# EAGLE design Tag_V1 (EAGLE 9.3.0)
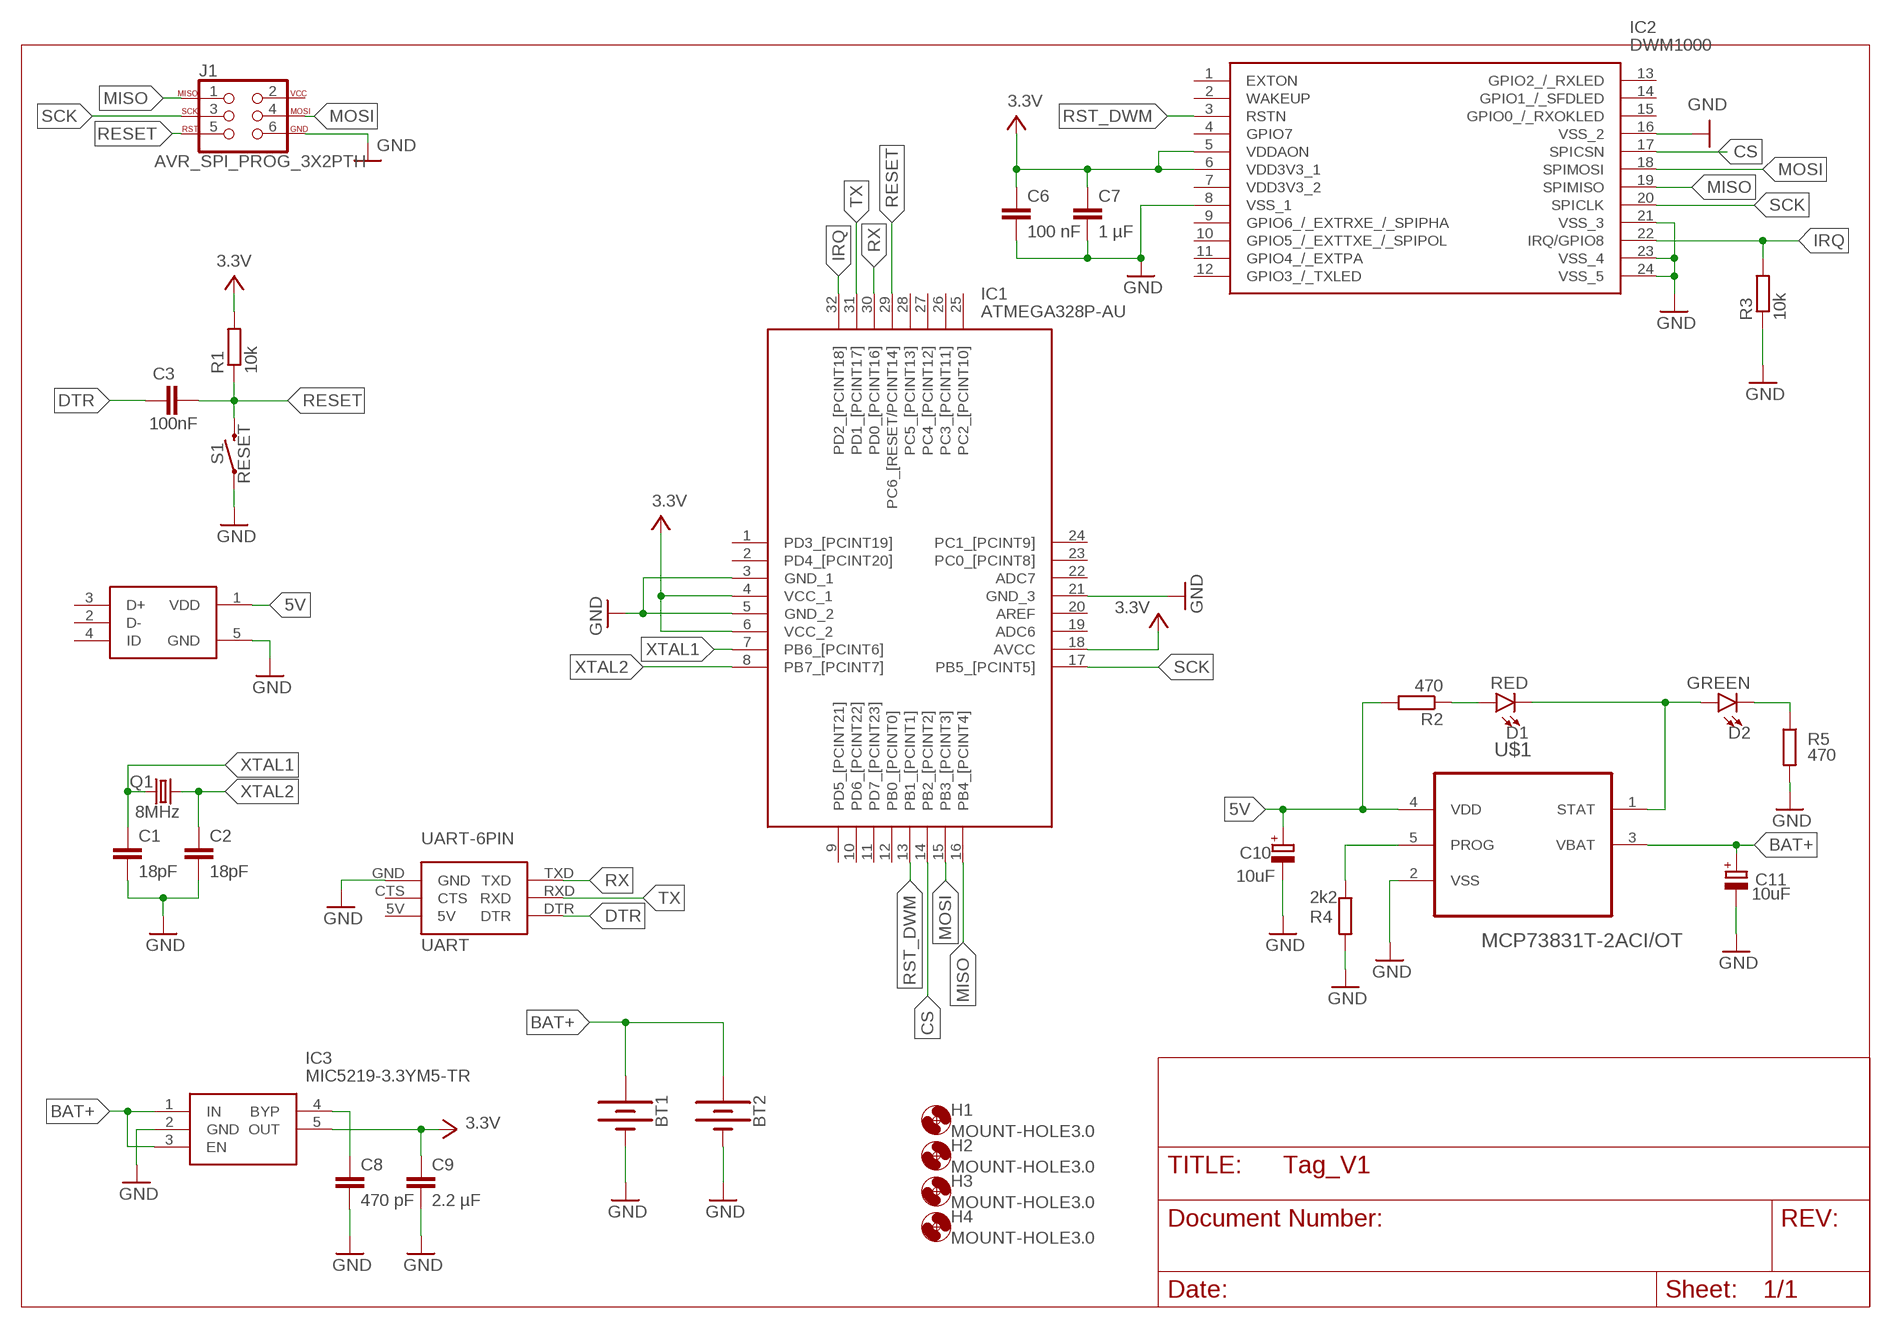
[diagram p0: schematic, sheet 1]

## Parts
BT1  BATTERY-18650  [BATTERY_18650-HOLDER]
BT2  BATTERY-18650  [BATTERY_18650-HOLDER]
C1  18pF  C-EUC0805  [C0805]
C2  18pF  C-EUC0805  [C0805]
C3  100nF  C-EUC0805  [C0805]
C6  100 nF  C-EUC0805  [C0805]
C7  1 µF  C-EUC0805  [C0805]
C8  470 pF  C-EUC0805  [C0805]
C9  2.2 µF  C-EUC0805  [C0805]
C10  10uF  CPOL-EUE2.5-7  [E2,5-7]
C11  10uF  CPOL-EUE2.5-7  [E2,5-7]
D1  RED  LED-RED1206  [LED-1206]
D2  GREEN  LED-GREEN1206  [LED-1206]
H1  MOUNT-HOLE3.0  [3,0]
H2  MOUNT-HOLE3.0  [3,0]
H3  MOUNT-HOLE3.0  [3,0]
H4  MOUNT-HOLE3.0  [3,0]
IC1  ATMEGA328P-AU  [QFP80P900X900X120-32N]
IC2  DWM1000  [DWM1000]
IC3  MIC5219-3.3YM5-TR  [SOT95P280X130-5N]
J1  AVR_SPI_PROG_3X2PTH  [2X3]
Q1  8MHz  CRYSTALHC49UP  [HC49UP]
R1  10k  R-EU_R0805  [R0805]
R2  470  R-EU_R0805  [R0805]
R3  10k  R-EU_R0805  [R0805]
R4  2k2  R-EU_R0805  [R0805]
R5  470  R-EU_R0805  [R0805]
S1  RESET  MOMENTARY-SWITCH-SPST-PTH-6.0MM  [TACTILE_SWITCH_PTH_6.0MM]
U1  105017-0001  [MOLEX_105017-0001]
U$1  MCP73831T-2ACI/OT  [SOT95P280X145-5N]
U$2  UART-6PIN  [UART-6PIN]

## Nets
3.3V: C6.1 C7.1 C9.1 IC1.4(VCC_1) IC1.6(VCC_2) IC1.18(AVCC) IC2.5(VDDAON) IC2.6(VDD3V3_1) IC3.5(OUT) R1.2 ; supply symbol labelled VCC
5V: C10.+ R2.2 U1.1(VDD) U$1.4(VDD)
BAT+: BT1.PWR@1(+) BT2.PWR@1(+) C11.+ IC3.1(IN) IC3.3(EN) U$1.3(VBAT)
CS: IC1.14(PB2_[PCINT2]) IC2.17(SPICSN)
DTR: C3.1 U$2.DTR
GND: BT1.GND@1(-) BT2.GND@1(-) C1.2 C2.2 C6.2 C7.2 C8.2 C9.2 C10.- C11.- IC1.3(GND_1) IC1.5(GND_2) IC1.21(GND_3) IC2.8(VSS_1) IC2.16(VSS_2) IC2.21(VSS_3) IC2.23(VSS_4) IC2.24(VSS_5) IC3.2(GND) J1.6 R3.1 R4.2 R5.2 S1.1 U1.5(GND) U$1.2(VSS) U$2.GND
IRQ: IC1.32(PD2_[PCINT18]) IC2.22(IRQ/GPIO8) R3.2
MISO: IC1.16(PB4_[PCINT4]) IC2.19(SPIMISO) J1.1
MOSI: IC1.15(PB3_[PCINT3]) IC2.18(SPIMOSI) J1.4
N$1: D1.C D2.A U$1.1(STAT)
N$2: D1.A R2.1
N$3: C8.1 IC3.4(BYP)
N$4: D2.C R5.1
N$6: R4.1 U$1.5(PROG)
RESET: C3.2 IC1.29(PC6_[RESET/PCINT14]) J1.5 R1.1 S1.3
RST_DWM: IC1.13(PB1_[PCINT1]) IC2.3(RSTN)
RX: IC1.30(PD0_[PCINT16]) U$2.TXD
SCK: IC1.17(PB5_[PCINT5]) IC2.20(SPICLK) J1.3
TX: IC1.31(PD1_[PCINT17]) U$2.RXD
XTAL1: C1.1 IC1.7(PB6_[PCINT6]) Q1.1
XTAL2: C2.1 IC1.8(PB7_[PCINT7]) Q1.2
Unconnected: IC1.1(PD3_[PCINT19]) IC1.2(PD4_[PCINT20]) IC1.9(PD5_[PCINT21]) IC1.10(PD6_[PCINT22]) IC1.11(PD7_[PCINT23]) IC1.12(PB0_[PCINT0]) IC1.19(ADC6) IC1.20(AREF) IC1.22(ADC7) IC1.23(PC0_[PCINT8]) IC1.24(PC1_[PCINT9]) IC1.25(PC2_[PCINT10]) IC1.26(PC3_[PCINT11]) IC1.27(PC4_[PCINT12]) IC1.28(PC5_[PCINT13]) IC2.1(EXTON) IC2.2(WAKEUP) IC2.4(GPIO7) IC2.7(VDD3V3_2) IC2.9(GPIO6_/_EXTRXE_/_SPIPHA) IC2.10(GPIO5_/_EXTTXE_/_SPIPOL) IC2.11(GPIO4_/_EXTPA) IC2.12(GPIO3_/_TXLED) IC2.13(GPIO2_/_RXLED) IC2.14(GPIO1_/_SFDLED) IC2.15(GPIO0_/_RXOKLED) J1.2 U1.2(D-) U1.3(D+) U1.4(ID) U$2.5V U$2.CTS

## Library data of the parts
BT1 BT2 = SparkFun-Batteries:BATTERY: Battery - Single Cell A variety of battery chemistries, sizes, and footprints. Device List: 20MM_PTH - Coin Cell Battery Holder - 20mm (PTH) <https://www.sparkfun.com/products/783> 20MM_PTH_KIT- Coin Cell battery Holder - 20 mm (PTH) <http://www.sparkfun.com/products/783>kit version with special mask 6.8MM_PTH - Coin Cell Battery Holder - 6.8MM(SMD) <https://www.digikey.com/product-detail/en/seiko-instruments/MS621FE-FL11E/728-1057-ND/1889208?WT.srch=1&gclid=CNOQ5a6LzdQCFZS2wAodXCkE0g> 12MM_SMD - Coin Cell Battery Holder - 12mm (SMD) <https://www.sparkfun.com/products/10592> 12MM_PTH - Coin Cell Battery Holder - 12mm (PTH) <https://www.sparkfun.com/products/7948> 20MM_SMD - 20mm Coin Cell Battery Holder (SMD) (2 legs) Used on the Big Time Watch Kit <https://www.sparkfun.com/products/11734> 20MM_SMD_4LEGS - Coin Cell Battery Holder - 20mm (SMD) <https://www.sparkfun.com/products/11892> 20MM_SMD_4LEGS_OVERPASTE - Coin Cell Battery Holder - 20mm (SMD) <https://www.sparkfun.com/products/11892> (Over-paste on the legs) 24.5MM_PTH - Coin Cell Battery Holder - 24.5mm (PTH) <https://www.sparkfun.com/products/8863> 9V - 9V Battery Holder - PC Mount Used on the SparkFun SparkPunk Sound Kit <https://www.sparkfun.com/products/11177> and SparkFun SparkPunk Sequencer Kit <https://www.sparkfun.com/products/12707> 18650 - Battery Holder - 18650 (PTH) <https://www.sparkfun.com/products/13113> AA - Battery Holder - 1xAA (PTH) <https://www.sparkfun.com/products/7949> AAA - Battery Holder - 1xAAA (PTH) <https://www.sparkfun.com/products/12718> AA_KIT - Battery Holder - 1xAA (PTH) <https://www.sparkfun.com/products/7949> Special kit package - pads only have exposed copper on one side of the board. AAA_KIT - Battery Holder - 1xAAA (PTH) <https://www.sparkfun.com/products/12718> Special kit package - pads only have exposed copper on one side of the board.; PROD_ID: BATT-12327; SF_SKU: PRT-13113
C1-C3 C6-C9 = rcl:C-EU: CAPACITOR, European symbol; SPICEPREFIX: C
C10 C11 = rcl:CPOL-EU: POLARIZED CAPACITOR, European symbol; SPICEPREFIX: C
D1 = SparkFun-LED:LED-RED: Red SMD LED Used in manufacturing of most products at SparkFun Packages: 0603 - SMD 0603 package [Product Link] <http://docs.avagotech.com/docs/AV02-0551EN> 0603 SMART - SMD 0603 SMART package ( more efficient and expensive)[Product Link] <http://www.osram-os.com/Graphics/XPic2/00077099_0.pdf> 1206 - SMD1206 package [Product Link] <https://www.sparkfun.com/datasheets/DevTools/LilyPad/Q150OVS4.pdff> SparkFun Products: Pro Mini 328 -5V <https://www.sparkfun.com/products/821> RedBoard <https://www.sparkfun.com/products/12757> IOIO-OTG <https://www.sparkfun.com/products/13613>; PROD_ID: DIO-09912
D2 = SparkFun-LED:LED-GREEN: Green SMD LED Used in manufacturing of various products at SparkFun Packages: 0603 - SMD 0603 package [Product Link] <http://www.futureelectronics.com/en/technologies/semiconductors/optoelectronics/leds/Pages/9894312-LTST-C190GKT.aspx?CrossPart=HSMG-C190&IM=0> LilyPad 1206 - SMD1206 LilyPad package [Product Link] <http://www.futureelectronics.com/en/Technologies/Product.aspx?ProductID=IN150NGHARVATEKCORPORATION2049943&IM=0> 1206 - SMD1206 package [Product Link] <http://www.futureelectronics.com/en/technologies/semiconductors/optoelectronics/leds/Pages/8315665-LTST-C150KGKT.aspx?IM=0> 1206 Bottom Mount -SMD 1206 Bottom Mount [Product Link] <http://www.digikey.com/product-detail/en/lite-on-inc/LTST-C230KGKT/160-1456-1-ND/386854> SparkFun Products: Pro Mini 328 -5V <https://www.sparkfun.com/products/821> RedBoard <https://www.sparkfun.com/products/12757> MP3 Trigger <https://www.sparkfun.com/products/13720> Makey Makey <https://www.sparkfun.com/products/11076>; PROD_ID: DIO-00862
H1-H4 = holes:MOUNT-HOLE: MOUNTING HOLE with drill center marker
IC1 = ATMEGA328P-AU:ATMEGA328P-AU: MICROCHIP - ATMEGA328P-AU. - MICROCONTROLLER MCU, 8 BIT, ATMEGA, 20MHZ, TQFP-32 Source: Datasheet <https://componentsearchengine.com/Datasheets/2/ATMEGA328P-AU.pdf>; ARROW_PART_NUMBER: ATMEGA328P-AU; ARROW_PRICE-STOCK: https://www.arrow.com/en/products/atmega328p-au/microchip-technology; DESCRIPTION: MICROCHIP - ATMEGA328P-AU. - MICROCONTROLLER MCU, 8 BIT, ATMEGA, 20MHZ, TQFP-32; HEIGHT: 1.2mm; MANUFACTURER_NAME: Microchip; MANUFACTURER_PART_NUMBER: ATMEGA328P-AU; RS_PART_NUMBER: 1310271; RS_PRICE-STOCK: http://uk.rs-online.com/web/p/products/1310271
IC2 = DWM1000:DWM1000: IEEE 802.15.4-2011 UWB Transceiver Module Source: Datasheet <http://www.decawave.com/sites/default/files/resources/dwm1000-datasheet-v1.3.pdf>; ARROW_PART_NUMBER: DWM1000; DESCRIPTION: IEEE 802.15.4-2011 UWB Transceiver Module; HEIGHT: mm; MANUFACTURER_NAME: Decawave; MANUFACTURER_PART_NUMBER: DWM1000
IC3 = MIC5219-3.3YM5-TR:MIC5219-3.3YM5-TR: LDO Regulator Pos 3.3V 0.5A Microchip MIC5219-3.3YM5-TR, LDO Voltage Regulator, 500mA, 3.3 V +/-2%, 2.5 12 Vin, 5-Pin SOT-23 Source: Datasheet <http://www.microchip.com/mymicrochip/filehandler.aspx?ddocname=en579712>; DESCRIPTION: LDO Regulator Pos 3.3V 0.5A Microchip MIC5219-3.3YM5-TR, LDO Voltage Regulator, 500mA, 3.3 V +/-2%, 2.5 12 Vin, 5-Pin SOT-23; HEIGHT: 1.3mm; MANUFACTURER_NAME: Microchip; MANUFACTURER_PART_NUMBER: MIC5219-3.3YM5-TR; MOUSER_PART_NUMBER: 998-MIC5219-3.3YM5TR; RS_PART_NUMBER: 9101685P; RS_PRICE-STOCK: http://uk.rs-online.com/web/p/products/9101685P
J1 = SparkFun-Connectors:AVR_SPI_PROG_3X2: AVR ISP 6 Pin This is the reduced ISP connector for AVR programming. Common on Arduino. This footprint will take up less PCB space and can be used with a 10-pin to 6-pin adapter such as SKU: BOB-08508 **Special note about "TEST_POINT" package. The stop mask is on the top side, so if you want your programming test points to be on the bottom of your board, make sure to place this package on the bottom side of the board. This also ensure that the orientation to program from the bottom side will be correct. SparkFun Products: SparkFun ISP Pogo Adapter <https://www.sparkfun.com/products/11591> - NS Tiny AVR Programmer <https://www.sparkfun.com/products/11801> -PTH
Q1 = crystal:CRYSTAL: CRYSTAL; OC_FARNELL: unknown; OC_NEWARK: unknown
R1-R5 = rcl:R-EU_: RESISTOR, European symbol; SPICEPREFIX: R
S1 = SparkFun-Switches:MOMENTARY-SWITCH-SPST: Momentary Switch (Pushbutton) - SPST Normally-open (NO) SPST momentary switches (buttons, pushbuttons). Variants PTH-12MM - 12mm square, through-hole Momentary Pushbutton Switch - 12mm Square <https://www.sparkfun.com/products/9190> (COM-09190) PTH-6.0MM, PTH-6.0MM-KIT - 6.0mm square, through-hole Mini Pushbutton Switch <https://www.sparkfun.com/products/97> (COM-00097) KIT package intended for soldering kit's - only one side of pads' copper is exposed. PTH-RIGHT-ANGLE-KIT - Right-angle, through-hole Right Angle Tactile Button <https://www.sparkfun.com/products/10791> - Used on SparkFun BigTime Watch Kit <https://www.sparkfun.com/products/11734> SMD-12MM - 12mm square, surface-mount Tactile Button - SMD (12mm) <https://www.sparkfun.com/products/12993> (COM-12993) Used on SparkFun PicoBoard <https://www.sparkfun.com/products/11888> SMD-4.5MM - 4.5mm Square Trackball Switch Used on SparkFun Blackberry Trackballer Breakout <https://www.sparkfun.com/products/13169> SMD-4.6MMX2.8MM - 4.60mm x 2.80mm, surface mount Used on SparkFun SAMD21 Mini Breakout <https://www.sparkfun.com/products/13664> SMD-5.2MM, SMD-5.2-REDUNDANT - 5.2mm square, surface-mount Mini Pushbutton Switch - SMD <https://www.sparkfun.com/products/8720> (COM-08720) Used on Arduino Pro Mini <https://www.sparkfun.com/products/11114> REDUNDANT package connects both switch circuits together SMD-6.0X3.5MM - 6.0 x 3.5mm, surface mount Momentary Reset Switch SMD <https://www.sparkfun.com/products/8229> (COM-08229) SMD-6.2MM-TALL - 6.2mm square, surface mount Tactile Button - SMD (6mm) <https://www.sparkfun.com/products/12992> Used on SparkFun Digital Sandbox <https://www.sparkfun.com/products/12651> SMD-RIGHT-ANGLE - Right-angle, surface mount Used on SparkFun Block for Intel® Edison - Arduino <https://www.sparkfun.com/products/13036>; PROD_ID: SWCH-08441; SF_SKU: COM-00097
U1 = 105017-0001:105017-0001; AVAILABILITY: Unavailable; DESCRIPTION: Conn USB Type B M 5 POS 0.65mm Solder RA Thru-Hole 5 Terminal 1 Port Embossed T/R; MF: Molex; MP: 105017-0001; PACKAGE: None; PRICE: None
U$1 = MCP73831T-2ACI_OT:MCP73831T-2ACI/OT: Charge Management Controller; AVAILABILITY: Unavailable; DESCRIPTION: MCP73831 Series Single-Cell Li-Ion/Li-Polymer Battery Charge Controller SOT-23-5; MF: Microchip; MP: MCP73831T-2ACI/OT; PACKAGE: SOT-23 Microchip; PRICE: None
U$2 = Eigen Library:UART-6PIN

## Board
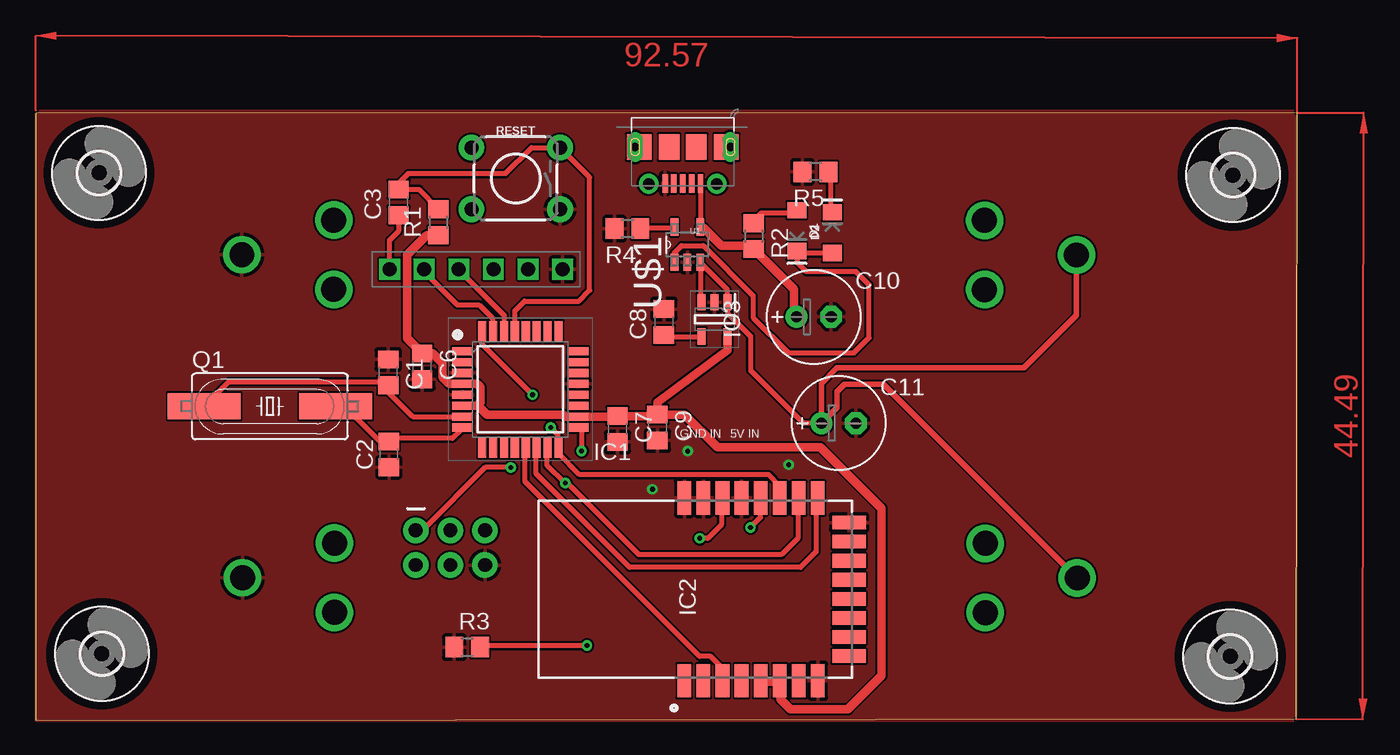
[diagram p1: board, top side]
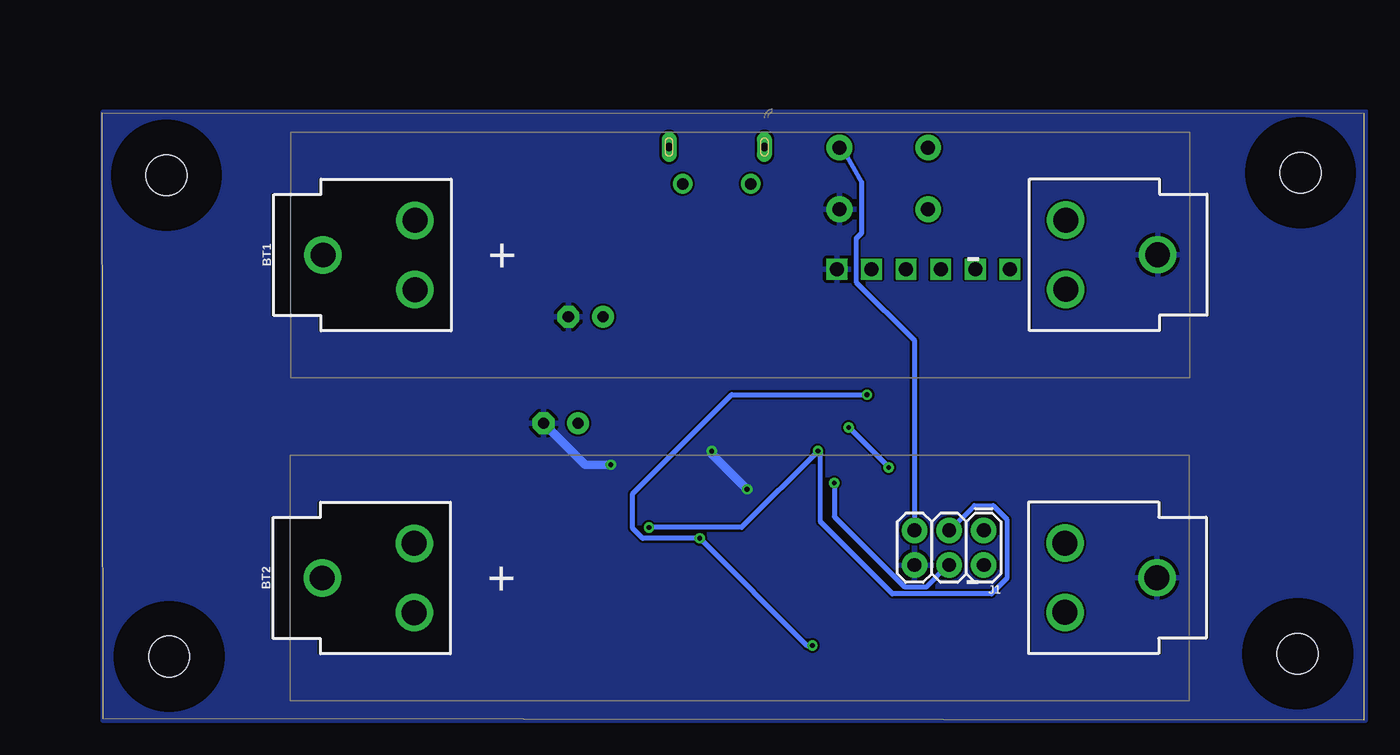
[diagram p2: board, bottom side, seen from below]

Size 92.57 x 44.59 mm. Coordinates in mm from the lower left corner, seen from the top.
Outline: 0,0 92.52,0.1 92.57,44.59 0,44.54 0,0
Copper layers (1*16): Top 0.035mm / dielectric 1.5mm / Bottom 0.035mm
Design rules "default *": minimum track width 15mil, minimum drill 0.35mm, track to track 6mil, track to pad 6mil, pad to pad 6mil, via to via 6mil, smd to smd 6mil, copper to edge 0mil, drill to drill 6mil, minimum pad ring 10mil, minimum via ring 8mil, stop-mask expansion 4mil, vias tented up to drill 0mil, thermal gap 10mil

### Footprints (pad centres in the part's own frame; a part is rotated, then mirrored left to right if it is on the bottom)
BATTERY_18650-HOLDER = drill 1.829: GND@1 30.628,0.01; GND@2 23.88,2.55; GND@3 23.88,-2.53; PWR@1 -30.628,-0.01; PWR@2 -23.88,2.53; PWR@3 -23.88,-2.55
C0805 = smd 1.3 x 1.5: 1 -0.95,0; 2 0.95,0
E2,5-7 = drill 0.813 pad 1.6: + -1.27,0 | drill 0.813 pad 1.6 octagon: - 1.27,0
LED-1206 = smd 1.2 x 1.4: A -1.5,0; C 1.5,0
3,0 = hole 3: 0,0
QFP80P900X900X120-32N = smd 1.5 x 0.6: 1 -4.25,2.8; 2 -4.25,2; 3 -4.25,1.2; 4 -4.25,0.4; 5 -4.25,-0.4; 6 -4.25,-1.2; 7 -4.25,-2; 8 -4.25,-2.8; 17 4.25,-2.8; 18 4.25,-2; 19 4.25,-1.2; 20 4.25,-0.4; 21 4.25,0.4; 22 4.25,1.2; 23 4.25,2; 24 4.25,2.8 | smd 0.6 x 1.5: 9 -2.8,-4.25; 10 -2,-4.25; 11 -1.2,-4.25; 12 -0.4,-4.25; 13 0.4,-4.25; 14 1.2,-4.25; 15 2,-4.25; 16 2.8,-4.25; 25 2.8,4.25; 26 2,4.25; 27 1.2,4.25; 28 0.4,4.25; 29 -0.4,4.25; 30 -1.2,4.25; 31 -2,4.25; 32 -2.8,4.25
DWM1000 = smd 2.45 x 1: 1 -6.705,12.3; 2 -6.705,10.9; 3 -6.705,9.5; 4 -6.705,8.1; 5 -6.705,6.7; 6 -6.705,5.3; 7 -6.705,3.9; 8 -6.705,2.5; 17 6.705,2.5; 18 6.705,3.9; 19 6.705,5.3; 20 6.705,6.7; 21 6.705,8.1; 22 6.705,9.5; 23 6.705,10.9; 24 6.705,12.3 | smd 1 x 2.45: 9 -4.9,0.205; 10 -3.5,0.205; 11 -2.1,0.205; 12 -0.7,0.205; 13 0.7,0.205; 14 2.1,0.205; 15 3.5,0.205; 16 4.9,0.205
SOT95P280X130-5N = smd 1.2 x 0.6: 1 -1.25,0.95; 2 -1.25,0; 3 -1.25,-0.95; 4 1.25,-0.95; 5 1.25,0.95
2X3 = drill 1.016 pad 1.88: 1 0,0; 2 0,2.54; 3 2.54,0; 4 2.54,2.54; 5 5.08,0; 6 5.08,2.54
HC49UP = smd 5.334 x 1.93: 1 -4.826,0; 2 4.826,0
R0805 = smd 1.3 x 1.5: 1 -0.95,0; 2 0.95,0
TACTILE_SWITCH_PTH_6.0MM = drill 1.016 pad 1.88: 1 -3.251,2.261; 2 3.251,2.261; 3 -3.251,-2.261; 4 3.251,-2.261
MOLEX_105017-0001 = smd 0.4 x 1.35: 1 -1.3,2.675; 2 -0.65,2.675; 3 0,2.675; 4 0.65,2.675; 5 1.3,2.675 | drill 0.85 pad 1.45: P$1 -2.5,2.7; P$2 2.5,2.7 | smd 1.5 x 1.9: P$8 -1,0; P$9 1,0 | smd 1.8 x 1.9: P$10 -3.2,0; P$11 3.2,0 | drill 0.6 pad 0.8 long: P$12 -3.5,0; P$13 3.5,0
SOT95P280X145-5N = smd 1.27 x 0.559: 1 -1.295,0.94; 2 -1.295,0; 3 -1.295,-0.94; 4 1.295,-0.94; 5 1.295,0.94
UART-6PIN = drill 1.02 pad 1.5 square: 5V 5.08,0; CTS 2.54,0; DTR 12.7,0; GND 0,0; RXD 10.16,0; TXD 7.62,0

### Placement (x,y rotation side)
BT1  45.75,34.15 0 bottom
BT2  45.8,10.45 0 bottom
C1  25.87,25.53 90 top
C2  25.91,19.51 270 top
C3  26.62,38 90 top
C6  28.35,25.97 270 top
C7  42.69,21.37 270 top
C8  46.1,29.22 90 top
C9  45.62,21.48 270 top
C10  57.1,29.6 0 top
C11  58.92,21.8 0 top
D1  55.85,35.92 270 top
D2  58.46,35.78 90 top
H1  87.86,39.99 0 top
H2  4.63,40.17 0 top
H3  4.84,4.88 0 top
H4  87.66,4.69 0 top
IC1  35.56,24.28 0 top
IC2  59.89,9.61 90 top
IC3  49.81,29.42 270 top
J1  27.88,13.93 180 bottom
Q1  17.18,23.04 0 top
R1  29.54,36.54 270 top
R2  52.68,35.52 270 top
R3  31.66,5.37 0 top
R4  43.42,36.07 180 top
R5  57.22,40.24 180 top
S1  35.22,39.76 180 top
U1  47.48,42.06 180 top
U$1  47.81,34.9 90 top
U$2  38.66,33.09 180 top

### Tracks (layer width: path | path; a pad name or v marks a point on that pad's centre or on a via)
3.3V
  Top 0.381: IC1.6 32.38,23.08 32.65,23.35
  Top 0.61: 32.19,23.09 31.39,23.09 IC1.6 | R1.2 28.69,35.59 27.25,34.15 27.25,28.02 C6.1 29.12,26.92 29.85,26.19 29.85,25.15 30.32,24.69 31.12,24.69 IC1.4 31.39,24.69 32.38,24.69 32.65,24.42 32.65,23.35 32.42,23.12 33.1,22.44 38.7,22.44 38.85,22.29 39.65,22.29 IC1.18 39.92,22.29 42.67,22.29 C7.1 45.62,22.32 C9.1 | IC2.5 53.25,2.82 54.59,2.82 IC2.6 54.66,2.88 54.66,1.55 55.39,0.82 59.59,0.82 62.05,3.28 62.05,15.55 57.58,20.03 50.02,20.03 47.62,22.43 C9.1 | IC3.5 50.75,27.15 45.62,23.33 C9.1
5V
  Top 0.381: U$1.4 48.77,36.22 U1.1
  Top 0.61: U$1.4 48.99,36.15 50.32,34.82 52.45,34.82 R2.2 52.72,34.55 55.66,31.62 55.66,29.75 C10.+
BAT+
  Top 0.381: U$1.3 48.79,33.57 48.79,30.74 IC3.3 | U$1.3 50.74,31.62 50.74,30.69 IC3.1 50.8,30.62 50.8,29.84 52.45,28.19 52.45,25.7 56.35,21.8 C11.+
  Top 0.406: U$1.3 | BT1.PWR@1 76.38,29.73 72.5,25.85 58.8,25.85 57.65,24.7 C11.+ 58.8,22.95 58.8,24.1 59.35,24.65 62.22,24.65 BT2.PWR@1
CS
  Top 0.381: IC1.14 36.72,19.89 36.72,18.09 43.59,11.22 56.12,11.22 57.26,12.35 57.26,16.15 IC2.17
DTR
  Top 0.381: C3.1 26.62,35.89 25.96,35.23 U$2.DTR
GND  (via drill 0.35)
  Bottom 0.61: v45.25,16.95 47.85,19.55 v47.85,19.75 | v55.25,18.75 57.14,18.75 C11.-
  pour Top: 0,-0.05 0,44.75 92.5,44.75 92.5,-0.05
  pour Bottom: -0.1,44.7 -0.1,0 92.5,0 92.5,44.6 0,44.6
IRQ  (via drill 0.35)
  Top 0.381: v40.45,5.48 32.72,5.48 R3.2 | v48.72,13.35 49.32,13.35 50.32,14.35 50.32,16.15 IC2.22 | v36.45,23.89 32.72,27.62 32.72,28.42 IC1.32
  Bottom 0.381: v40.45,5.48 40.85,5.48 v48.72,13.35 52.92,13.35 53.65,14.09 53.65,16.62 46.39,23.89 v36.45,23.89
MISO  (via drill 0.35)
  Top 0.381: IC2.19 54.59,16.42 54.59,17.22 53.79,18.02 39.92,18.02 38.39,19.55 38.39,20.01 IC1.16 38.32,20.15 38.32,20.95 v37.79,21.49 | v34.85,18.55 32.98,18.55 28.45,14.02 27.92,14.02 J1.1
  Bottom 0.381: v37.79,21.49 v34.85,18.55
MOSI  (via drill 0.35)
  Top 0.381: IC1.15 37.52,19.89 37.52,18.69 38.79,17.42 v38.85,17.42 38.99,17.42 44.25,12.15 54.72,12.15 55.92,13.35 55.92,16.15 IC2.18
  Bottom 0.381: v38.85,17.42 38.85,14.95 33.72,9.82 32.05,9.82 30.49,11.38 J1.4
N$1
  Top 0.381: U$1.1 46.87,34.3 47.39,34.82 48.99,34.82 52.65,31.16 52.65,29.55 55.25,26.95 60.05,26.95 61.15,28.05 61.15,31.97 60.2,32.92 56.55,32.92 55.85,33.62 D1.C 55.99,34.16 55.99,34.28 D2.A | U$1.1
N$2
  Top 0.381: D1.A 55.66,37.22 53.25,37.22 52.72,36.69 R2.1
N$3
  Top 0.381: IC3.4 48.72,28.15 46.32,28.15 C8.1
N$4
  Top 0.381: D2.C 58.32,37.49 58.32,40.16 R5.1
N$6
  Top 0.381: U$1.5 46.85,36.15 44.45,36.15 R4.1
RESET
  Top 0.381: R1.1 29.54,37.54 28.12,38.95 C3.2 26.62,39.4 27.32,40.1 34.45,40.1 36.37,42.02 S1.3 40.65,39.84 40.65,31.55 39.85,30.75 35.85,30.75 35.16,30.06 IC1.29 35.12,28.69
  Bottom 0.381: J1.5 32.98,14.02 32.98,27.89 37.25,32.15 37.25,35.35 36.85,35.75 36.85,39.49 38.12,41.67 S1.3
RST_DWM
  Top 0.381: IC1.13 35.92,19.89 35.92,17.48 48.72,4.68 49.52,4.68 50.32,3.88 50.32,3.08 IC2.3
RX
  Top 0.381: IC1.30 34.37,28.54 34.37,29.7 31.12,32.95 U$2.TXD
SCK  (via drill 0.35)
  Top 0.381: IC1.17 40.05,21.24 v40.05,19.75 | v52.45,14.15 53.19,14.88 IC2.20
  Bottom 0.381: v40.05,19.75 | J1.3 30.32,14.02 28.59,15.75 27.18,15.75 26.18,14.75 26.18,10.42 27.32,9.28 34.59,9.28 39.85,14.55 39.85,19.55 v40.05,19.75 | v40.05,19.75 45.65,14.15 v52.45,14.15
TX
  Top 0.381: IC1.31 33.52,28.69 33.52,29.49 32.52,30.49 30.92,30.49 29.04,32.37 U$2.RXD
XTAL1
  Top 0.381: Q1.1 14.15,24.84 25.83,24.84 C1.1 25.87,24.07 27.65,22.29 31.12,22.29 IC1.7
XTAL2
  Top 0.381: C2.1 26.12,20.69 30.59,20.69 31.12,21.22 IC1.8 | 25.85,20.42 C2.1 | Q1.2 22.65,23.04 25.23,20.46 C2.1
(copper drawn outside any net)
  shapes: Top area x2

### Text on the board
tNames: GND IN | 5V IN